# Altium schematic sheet MotorDriver.SchDoc
size A
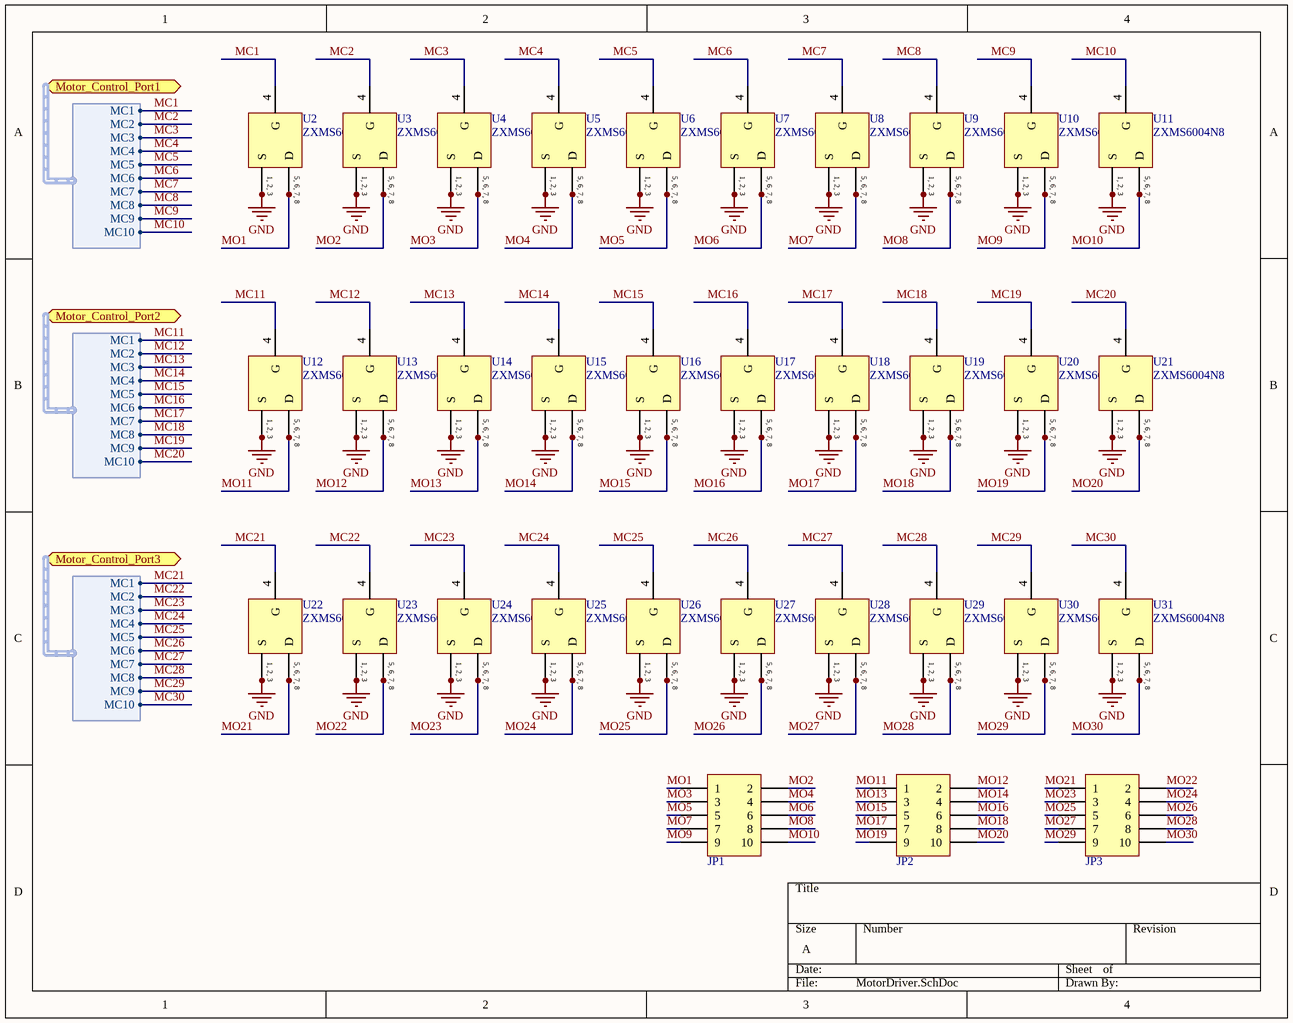
[diagram p0: MotorDriver.SchDoc]

## Parts
JP1  Header 5x2 2.54mm  [2X5]  (value not drawn)
JP2  Header 5x2 2.54mm  [2X5]  (value not drawn)
JP3  Header 5x2 2.54mm  [2X5]  (value not drawn)
U2  ZXMS6004N8  [SO-8]
U3  ZXMS6004N8  [SO-8]
U4  ZXMS6004N8  [SO-8]
U5  ZXMS6004N8  [SO-8]
U6  ZXMS6004N8  [SO-8]
U7  ZXMS6004N8  [SO-8]
U8  ZXMS6004N8  [SO-8]
U9  ZXMS6004N8  [SO-8]
U10  ZXMS6004N8  [SO-8]
U11  ZXMS6004N8  [SO-8]
U12  ZXMS6004N8  [SO-8]
U13  ZXMS6004N8  [SO-8]
U14  ZXMS6004N8  [SO-8]
U15  ZXMS6004N8  [SO-8]
U16  ZXMS6004N8  [SO-8]
U17  ZXMS6004N8  [SO-8]
U18  ZXMS6004N8  [SO-8]
U19  ZXMS6004N8  [SO-8]
U20  ZXMS6004N8  [SO-8]
U21  ZXMS6004N8  [SO-8]
U22  ZXMS6004N8  [SO-8]
U23  ZXMS6004N8  [SO-8]
U24  ZXMS6004N8  [SO-8]
U25  ZXMS6004N8  [SO-8]
U26  ZXMS6004N8  [SO-8]
U27  ZXMS6004N8  [SO-8]
U28  ZXMS6004N8  [SO-8]
U29  ZXMS6004N8  [SO-8]
U30  ZXMS6004N8  [SO-8]
U31  ZXMS6004N8  [SO-8]

## Ports
Motor_Control_Port1 (harness MCP), Motor_Control_Port2 (harness MCP), Motor_Control_Port3 (harness MCP)

## Harnesses
MCP: MC1, MC2, MC3, MC4, MC5, MC6, MC7, MC8, MC9, MC10

## Nets
GND: U2.1(S) U2.2(S) U2.3(S) U3.1(S) U3.2(S) U3.3(S) U4.1(S) U4.2(S) U4.3(S) U5.1(S) U5.2(S) U5.3(S) U6.1(S) U6.2(S) U6.3(S) U7.1(S) U7.2(S) U7.3(S) U8.1(S) U8.2(S) U8.3(S) U9.1(S) U9.2(S) U9.3(S) U10.1(S) U10.2(S) U10.3(S) U11.1(S) U11.2(S) U11.3(S) U12.1(S) U12.2(S) U12.3(S) U13.1(S) U13.2(S) U13.3(S) U14.1(S) U14.2(S) U14.3(S) U15.1(S) U15.2(S) U15.3(S) U16.1(S) U16.2(S) U16.3(S) U17.1(S) U17.2(S) U17.3(S) U18.1(S) U18.2(S) U18.3(S) U19.1(S) U19.2(S) U19.3(S) U20.1(S) U20.2(S) U20.3(S) U21.1(S) U21.2(S) U21.3(S) U22.1(S) U22.2(S) U22.3(S) U23.1(S) U23.2(S) U23.3(S) U24.1(S) U24.2(S) U24.3(S) U25.1(S) U25.2(S) U25.3(S) U26.1(S) U26.2(S) U26.3(S) U27.1(S) U27.2(S) U27.3(S) U28.1(S) U28.2(S) U28.3(S) U29.1(S) U29.2(S) U29.3(S) U30.1(S) U30.2(S) U30.3(S) U31.1(S) U31.2(S) U31.3(S)
MC1: U2.4(G) ; port Motor_Control_Port1.MC1
MC2: U3.4(G) ; port Motor_Control_Port1.MC2
MC3: U4.4(G) ; port Motor_Control_Port1.MC3
MC4: U5.4(G) ; port Motor_Control_Port1.MC4
MC5: U6.4(G) ; port Motor_Control_Port1.MC5
MC6: U7.4(G) ; port Motor_Control_Port1.MC6
MC7: U8.4(G) ; port Motor_Control_Port1.MC7
MC8: U9.4(G) ; port Motor_Control_Port1.MC8
MC9: U10.4(G) ; port Motor_Control_Port1.MC9
MC10: U11.4(G) ; port Motor_Control_Port1.MC10
MC11: U12.4(G) ; port Motor_Control_Port2.MC1
MC12: U13.4(G) ; port Motor_Control_Port2.MC2
MC13: U14.4(G) ; port Motor_Control_Port2.MC3
MC14: U15.4(G) ; port Motor_Control_Port2.MC4
MC15: U16.4(G) ; port Motor_Control_Port2.MC5
MC16: U17.4(G) ; port Motor_Control_Port2.MC6
MC17: U18.4(G) ; port Motor_Control_Port2.MC7
MC18: U19.4(G) ; port Motor_Control_Port2.MC8
MC19: U20.4(G) ; port Motor_Control_Port2.MC9
MC20: U21.4(G) ; port Motor_Control_Port2.MC10
MC21: U22.4(G) ; port Motor_Control_Port3.MC1
MC22: U23.4(G) ; port Motor_Control_Port3.MC2
MC23: U24.4(G) ; port Motor_Control_Port3.MC3
MC24: U25.4(G) ; port Motor_Control_Port3.MC4
MC25: U26.4(G) ; port Motor_Control_Port3.MC5
MC26: U27.4(G) ; port Motor_Control_Port3.MC6
MC27: U28.4(G) ; port Motor_Control_Port3.MC7
MC28: U29.4(G) ; port Motor_Control_Port3.MC8
MC29: U30.4(G) ; port Motor_Control_Port3.MC9
MC30: U31.4(G) ; port Motor_Control_Port3.MC10
MO1: JP1.1 U2.5(D) U2.6(D) U2.7(D) U2.8(D)
MO2: JP1.2 U3.5(D) U3.6(D) U3.7(D) U3.8(D)
MO3: JP1.3 U4.5(D) U4.6(D) U4.7(D) U4.8(D)
MO4: JP1.4 U5.5(D) U5.6(D) U5.7(D) U5.8(D)
MO5: JP1.5 U6.5(D) U6.6(D) U6.7(D) U6.8(D)
MO6: JP1.6 U7.5(D) U7.6(D) U7.7(D) U7.8(D)
MO7: JP1.7 U8.5(D) U8.6(D) U8.7(D) U8.8(D)
MO8: JP1.8 U9.5(D) U9.6(D) U9.7(D) U9.8(D)
MO9: JP1.9 U10.5(D) U10.6(D) U10.7(D) U10.8(D)
MO10: JP1.10 U11.5(D) U11.6(D) U11.7(D) U11.8(D)
MO11: JP2.1 U12.5(D) U12.6(D) U12.7(D) U12.8(D)
MO12: JP2.2 U13.5(D) U13.6(D) U13.7(D) U13.8(D)
MO13: JP2.3 U14.5(D) U14.6(D) U14.7(D) U14.8(D)
MO14: JP2.4 U15.5(D) U15.6(D) U15.7(D) U15.8(D)
MO15: JP2.5 U16.5(D) U16.6(D) U16.7(D) U16.8(D)
MO16: JP2.6 U17.5(D) U17.6(D) U17.7(D) U17.8(D)
MO17: JP2.7 U18.5(D) U18.6(D) U18.7(D) U18.8(D)
MO18: JP2.8 U19.5(D) U19.6(D) U19.7(D) U19.8(D)
MO19: JP2.9 U20.5(D) U20.6(D) U20.7(D) U20.8(D)
MO20: JP2.10 U21.5(D) U21.6(D) U21.7(D) U21.8(D)
MO21: JP3.1 U22.5(D) U22.6(D) U22.7(D) U22.8(D)
MO22: JP3.2 U23.5(D) U23.6(D) U23.7(D) U23.8(D)
MO23: JP3.3 U24.5(D) U24.6(D) U24.7(D) U24.8(D)
MO24: JP3.4 U25.5(D) U25.6(D) U25.7(D) U25.8(D)
MO25: JP3.5 U26.5(D) U26.6(D) U26.7(D) U26.8(D)
MO26: JP3.6 U27.5(D) U27.6(D) U27.7(D) U27.8(D)
MO27: JP3.7 U28.5(D) U28.6(D) U28.7(D) U28.8(D)
MO28: JP3.8 U29.5(D) U29.6(D) U29.7(D) U29.8(D)
MO29: JP3.9 U30.5(D) U30.6(D) U30.7(D) U30.8(D)
MO30: JP3.10 U31.5(D) U31.6(D) U31.7(D) U31.8(D)

## Notes on the sheet
- (in symbol ZXMS6004N8) 1, 2, 3; 5, 6, 7, 8

## Library data of the parts
JP1-JP3 = Header 5x2: Header, 8-Pin; Supplier 1: Farnell; Supplier Part Number 1: 1593440
U2-U31 = ZXMS6004N8: MOSFET N-CH 60V 1.3A S08; Manufacturer: On Semiconductor; PartNumber: NCV8402ASTT1G; Packing: Tape and Reel; Channel Polarity: N Channel; ComponentLink3Description: Package Specification; ComponentLink3URL: http://www.onsemi.com/pub_link/Collateral/318E-04.PDF; ComponentLink1URL: http://www.onsemi.com/; PackageDescription: 4-Pin Small Outline Transistor, Body 6.5 x 3.5 mm, Pitch 2.3 mm; DatasheetVersion: Rev. 8; ComponentLink1Description: Manufacturer URL; Mounting Technology: Surface Mount; PackageVersion: Rev. N, 08/2009; PackageReference: SOT-223-4-318E-04; ComponentLink2URL: http://www.onsemi.com/pub_link/Collateral/NCV8402-D.PDF; ComponentLink2Description: Datasheet; RoHS: Pb-Free